# Altium project Slave_Power.PrjPcb
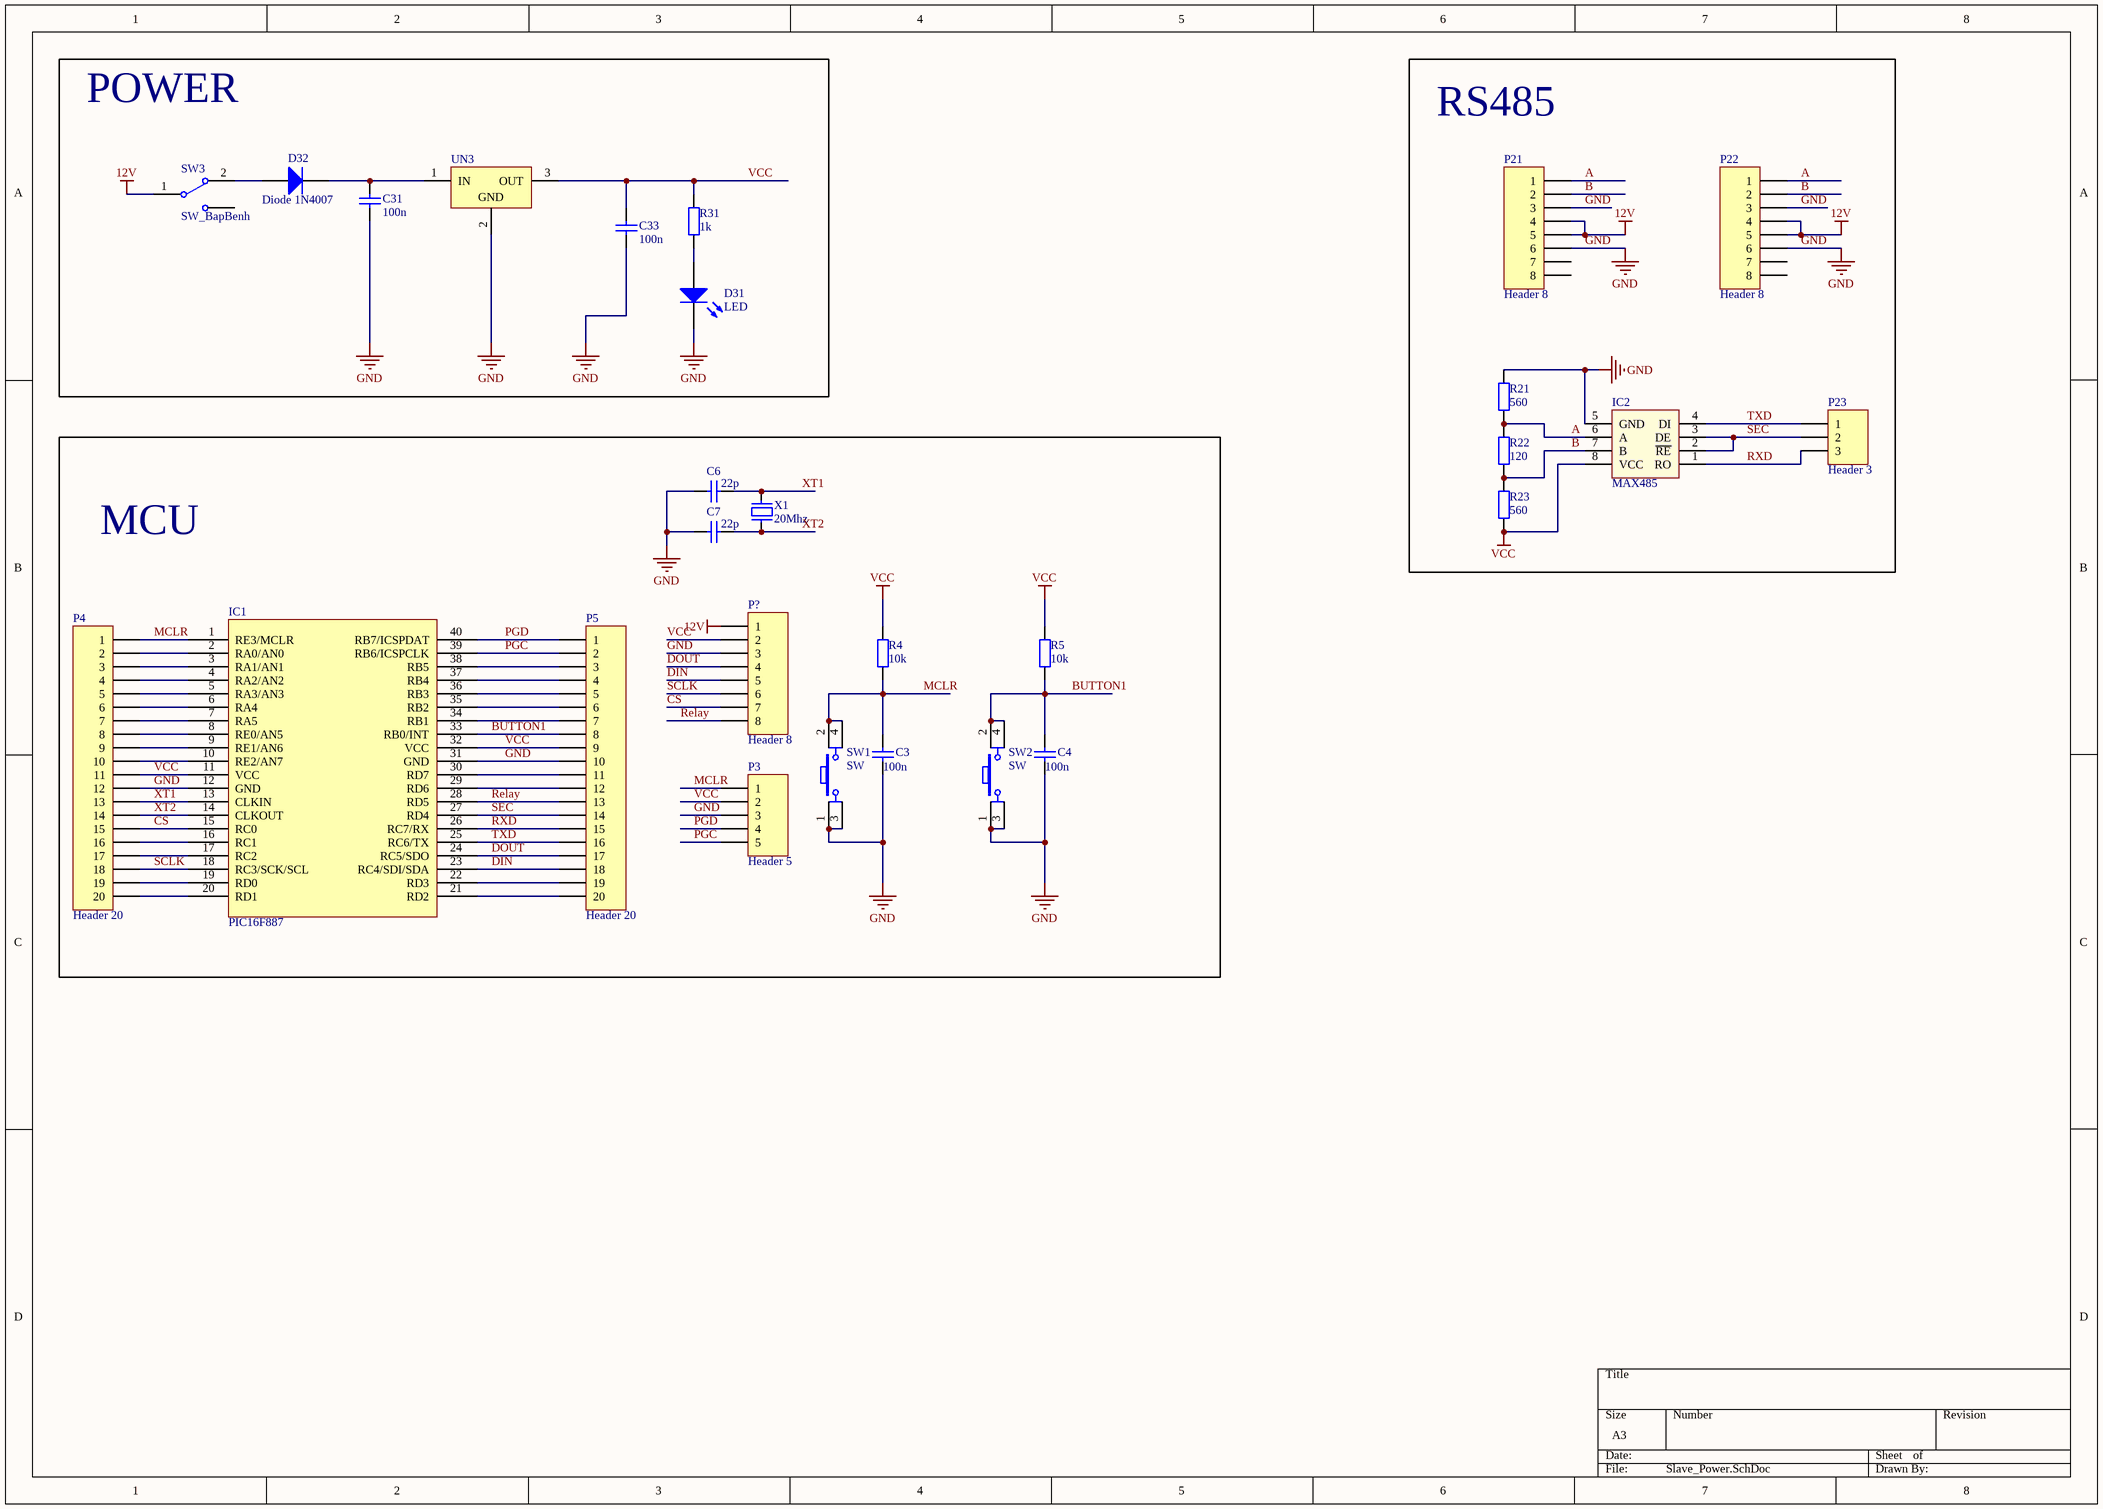
[diagram p0: Slave_Power.SchDoc]
1 sheet, 28 parts. Net scope: global (net labels, ports and power ports of the same name join across sheets).
Board file: Slave_Power.PcbDoc

## Sheet Slave_Power.SchDoc
size A3

### Parts
C3  value 100n  [CAP_SMD_0805]  (hidden comment: Capacitor Ceramic)
C4  value 100n  [CAP_SMD_0805]  (hidden comment: Capacitor Ceramic)
C6  value 22p  [C-NP-0805]  (hidden comment: Cap Non-pol)
C7  value 22p  [C-NP-0805]  (hidden comment: Cap Non-pol)
C31  value 100n  [C-NP-0805]  (hidden comment: Cap Non-pol)
C33  value 100n  [C-NP-0805]  (hidden comment: Cap Non-pol)
D31  LED  [LED-0805 RED]
D32  Diode 1N4007  [DO-41]
IC1  PIC16F887  [DIP40/W0.6]
IC2  MAX485  [DIP8/W0.3]
P3  Header 5  [Header 5]
P4  Header 20  [Header 20]
P5  Header 20  [Header 20]
P21  Header 8  [RJ11]
P22  Header 8  [RJ11]
P23  Header 3  [Header 3]
P?  Header 8  [Header 8]
R4  value 10k  [DIEN TRO 0805]  (hidden comment: RES_SMD_0805)
R5  value 10k  [DIEN TRO 0805]  (hidden comment: RES_SMD_0805)
R21  value 560  [DIEN TRO 0805]  (hidden comment: RES_SMD_0805)
R22  value 120  [DIEN TRO 0805]  (hidden comment: RES_SMD_0805)
R23  value 560  [DIEN TRO 0805]  (hidden comment: RES_SMD_0805)
R31  value 1k  [DIEN TRO 0805]  (hidden comment: RES_SMD_0805)
SW1  SW  [SW4]
SW2  SW  [SW4B]
SW3  SW_BapBenh  [SW_Bapbenh]
UN3  L78M05CP  [QTO-220]  (value not drawn)
X1  20Mhz  [XT2]

### Blocks framed on the sheet
RS485: IC2 P21-P23 R21-R23

### Nets
12V: P21.4 P21.5 P22.4 P22.5 P?.1 SW3.1
GND: C3.1 C4.1 C6.2 C7.2 C31.1 C33.1 D31.2(K) IC1.12(GND) IC1.31(GND) IC2.5(GND) P3.3 P4.12 P5.10 P21.3 P21.6 P22.3 P22.6 P?.3 R21.2 SW1.1 SW1.3 SW2.1 SW2.3 UN3.2(GND)
VCC: C33.2 IC1.11(VCC) IC1.32(VCC) IC2.8(VCC) P3.2 P4.11 P5.9 P?.2 R4.2 R5.2 R23.1 R31.2 UN3.3(OUT)
A: IC2.6(A) P21.1 P22.1 R21.1 R22.2
B: IC2.7(B) P21.2 P22.2 R22.1 R23.2
BUTTON1: C4.2 IC1.33(RB0/INT) P5.8 R5.1 SW2.2 SW2.4
CS: IC1.15(RC0) P4.15 P?.7
DIN: IC1.23(RC4/SDI/SDA) P5.18 P?.5
DOUT: IC1.24(RC5/SDO) P5.17 P?.4
MCLR: C3.2 IC1.1(RE3/MCLR) P3.1 P4.1 R4.1 SW1.2 SW1.4
PGC: IC1.39(RB6/ICSPCLK) P3.5 P5.2
PGD: IC1.40(RB7/ICSPDAT) P3.4 P5.1
Relay: IC1.28(RD5) P5.13 P?.8
RXD: IC1.26(RC7/RX) IC2.1(RO) P5.15 P23.3
SCLK: IC1.18(RC3/SCK/SCL) P4.18 P?.6
SEC: IC1.27(RD4) IC2.2(~{RE}) IC2.3(DE) P5.14 P23.2
TXD: IC1.25(RC6/TX) IC2.4(DI) P5.16 P23.1
XT1: C6.1 IC1.13(CLKIN) P4.13 X1.2
XT2: C7.1 IC1.14(CLKOUT) P4.14 X1.1
NetC31_2: C31.2 D32.2(K) UN3.1(IN)
NetD31_1: D31.1(A) R31.1
NetD32_1: D32.1(A) SW3.2
NetIC1_2: IC1.2(RA0/AN0) P4.2
NetIC1_3: IC1.3(RA1/AN1) P4.3
NetIC1_4: IC1.4(RA2/AN2) P4.4
NetIC1_5: IC1.5(RA3/AN3) P4.5
NetIC1_6: IC1.6(RA4) P4.6
NetIC1_7: IC1.7(RA5) P4.7
NetIC1_8: IC1.8(RE0/AN5) P4.8
NetIC1_9: IC1.9(RE1/AN6) P4.9
NetIC1_10: IC1.10(RE2/AN7) P4.10
NetIC1_16: IC1.16(RC1) P4.16
NetIC1_17: IC1.17(RC2) P4.17
NetIC1_19: IC1.19(RD0) P4.19
NetIC1_20: IC1.20(RD1) P4.20
NetIC1_21: IC1.21(RD2) P5.20
NetIC1_22: IC1.22(RD3) P5.19
NetIC1_29: IC1.29(RD6) P5.12
NetIC1_30: IC1.30(RD7) P5.11
NetIC1_34: IC1.34(RB1) P5.7
NetIC1_35: IC1.35(RB2) P5.6
NetIC1_36: IC1.36(RB3) P5.5
NetIC1_37: IC1.37(RB4) P5.4
NetIC1_38: IC1.38(RB5) P5.3

Not connected (* = marked no-connect by the designer): P21 7 8; P22 7 8

### Notes on the sheet
- POWER
- MCU

### Library data of the parts
C3 C4 = CapSMD: Capacitor; Published: 8-Jun-2000; LatestRevisionDate: 17-Jul-2002; LatestRevisionNote: Re-released for DXP Platform.; PackageReference: RAD-0.3; Publisher: Altium Limited
C6 C7 C31 C33 = Cap Non-pol: Non-polarized Capacitor; Published: 8-Jun-2000; LatestRevisionDate: 17-Jul-2002; LatestRevisionNote: Re-released for DXP Platform.; PackageReference: RAD-0.3; Publisher: Altium Limited
D31 = LED: Typical LED; Published: 8-Jun-2000; LatestRevisionDate: 08-Jul-2005; LatestRevisionNote: Mech Layer 1 removed.; PackageReference: LED-1; Publisher: Altium Limited
D32 = Diode 1N4007: 1 Amp General Purpose Rectifier; Published: 8-Jun-2000; LatestRevisionDate: 17-Jul-2002; LatestRevisionNote: Re-released for DXP Platform.; DatasheetVersion: 1998; PackageVersion: Aug-1999; PackageReference: DO-41; Publisher: Altium Limited; PackageDescription: Diode, Axial; Body 5.2 x 2.7 mm (LxDia. max), Lead Dia. 0.86 mm (max); Code_JEDEC: DO-204-AL; ComponentLink1Description: Manufacturer Link; ComponentLink1URL: http://www.fairchildsemi.com/; ComponentLink2Description: Datasheet; ComponentLink2URL: http://www.fairchildsemi.com/ds/1N%2F1N4001.pdf
IC2 = MAX485: RS232 - RS485 (Same sn75176)
P3 = Header 5: Header, 5-Pin; LatestRevisionDate: 17-Jul-2002; LatestRevisionNote: Re-released for DXP Platform.; Publisher: Altium Limited
P4 P5 = Header 20: Header, 20-Pin; LatestRevisionDate: 17-Jul-2002; LatestRevisionNote: Re-released for DXP Platform.; Publisher: Altium Limited
P21 P22 P? = Header 8: Header, 8-Pin; LatestRevisionDate: 17-Jul-2002; LatestRevisionNote: Re-released for DXP Platform.; Publisher: Altium Limited
P23 = Header 3: Header, 3-Pin; LatestRevisionDate: 17-Jul-2002; LatestRevisionNote: Re-released for DXP Platform.; Publisher: Altium Limited
R4 R5 R21-R23 R31 = RES_SMD_0805: RES_0805; Published: 8-Jun-2000; LatestRevisionDate: 17-Jul-2002; LatestRevisionNote: Re-released for DXP Platform.; PackageReference: AXIAL-0.4; Publisher: Altium Limited
SW1 SW2 = SW4: Switch button 4 pin; Value: Button chip 4 pin
UN3 = L78M05CP: Positive Voltage Regulator; Note: Tab is connected to pin 3 (GND).; Published: 24-Aug-2001; LatestRevisionDate: 17-Jul-2002; LatestRevisionNote: Re-released for DXP Platform.; DatasheetVersion: Apr-1994; PackageVersion: Jul-1998; PackageReference: ISOWATT220AB; Publisher: Altium Limited; PackageDescription: TO, Thru-Hole, Vertical, Heatsink Mounted; 3 In-Line Leads; Pitch 2.54 mm; Pin sequence 1, 3, 2; ComponentLink1Description: Manufacturer Link; ComponentLink1URL: http://www.st.com/; ComponentLink2Description: Datasheet; ComponentLink2URL: http://www.st.com/stonline/products/literature/ds/2146/l78m05c.pdf
X1 = XT2: Crystal For all Crystal 2pin.; Value: 4Mhz